# EAGLE design Display (EAGLE 8.5.1)
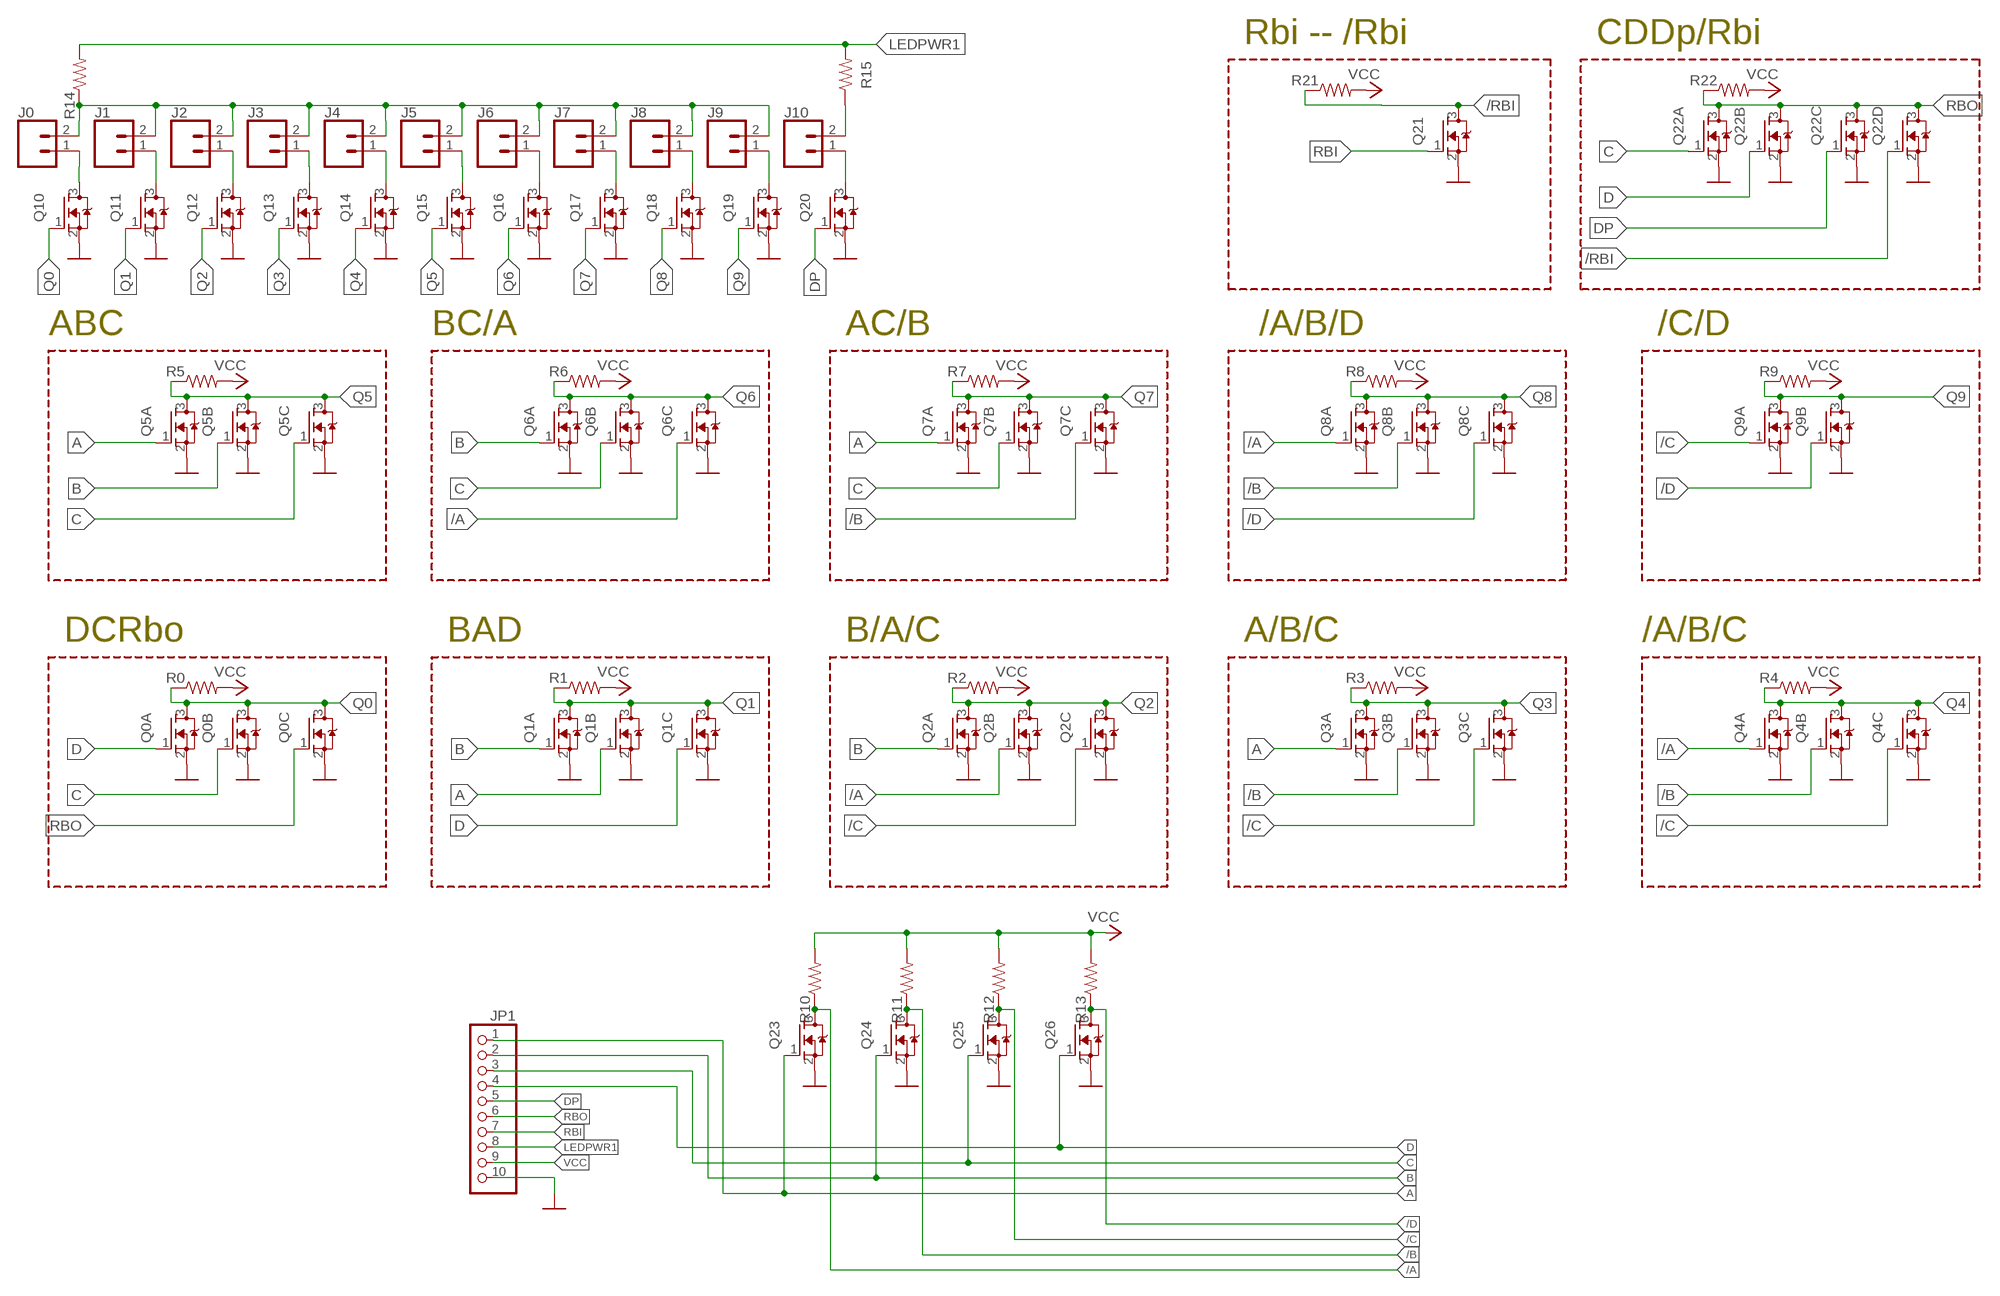
[diagram p0: schematic, sheet 1]

## Parts
J0  CONN_02  [1X02]
J1  CONN_02  [1X02]
J2  CONN_02  [1X02]
J3  CONN_02  [1X02]
J4  CONN_02  [1X02]
J5  CONN_02  [1X02]
J6  CONN_02  [1X02]
J7  CONN_02  [1X02]
J8  CONN_02  [1X02]
J9  CONN_02  [1X02]
J10  CONN_02  [1X02]
JP1  PINHD-1X10/90  [1X10/90]
Q0A  310mA/60V/1.6Ω  NMOSREFLOW  [SOT23]
Q0B  310mA/60V/1.6Ω  NMOSREFLOW  [SOT23]
Q0C  310mA/60V/1.6Ω  NMOSREFLOW  [SOT23]
Q1A  310mA/60V/1.6Ω  NMOSREFLOW  [SOT23]
Q1B  310mA/60V/1.6Ω  NMOSREFLOW  [SOT23]
Q1C  310mA/60V/1.6Ω  NMOSREFLOW  [SOT23]
Q2A  310mA/60V/1.6Ω  NMOSREFLOW  [SOT23]
Q2B  310mA/60V/1.6Ω  NMOSREFLOW  [SOT23]
Q2C  310mA/60V/1.6Ω  NMOSREFLOW  [SOT23]
Q3A  310mA/60V/1.6Ω  NMOSREFLOW  [SOT23]
Q3B  310mA/60V/1.6Ω  NMOSREFLOW  [SOT23]
Q3C  310mA/60V/1.6Ω  NMOSREFLOW  [SOT23]
Q4A  310mA/60V/1.6Ω  NMOSREFLOW  [SOT23]
Q4B  310mA/60V/1.6Ω  NMOSREFLOW  [SOT23]
Q4C  310mA/60V/1.6Ω  NMOSREFLOW  [SOT23]
Q5A  310mA/60V/1.6Ω  NMOSREFLOW  [SOT23]
Q5B  310mA/60V/1.6Ω  NMOSREFLOW  [SOT23]
Q5C  310mA/60V/1.6Ω  NMOSREFLOW  [SOT23]
Q6A  310mA/60V/1.6Ω  NMOSREFLOW  [SOT23]
Q6B  310mA/60V/1.6Ω  NMOSREFLOW  [SOT23]
Q6C  310mA/60V/1.6Ω  NMOSREFLOW  [SOT23]
Q7A  310mA/60V/1.6Ω  NMOSREFLOW  [SOT23]
Q7B  310mA/60V/1.6Ω  NMOSREFLOW  [SOT23]
Q7C  310mA/60V/1.6Ω  NMOSREFLOW  [SOT23]
Q8A  310mA/60V/1.6Ω  NMOSREFLOW  [SOT23]
Q8B  310mA/60V/1.6Ω  NMOSREFLOW  [SOT23]
Q8C  310mA/60V/1.6Ω  NMOSREFLOW  [SOT23]
Q9A  310mA/60V/1.6Ω  NMOSREFLOW  [SOT23]
Q9B  310mA/60V/1.6Ω  NMOSREFLOW  [SOT23]
Q10  310mA/60V/1.6Ω  NMOSREFLOW  [SOT23]
Q11  310mA/60V/1.6Ω  NMOSREFLOW  [SOT23]
Q12  310mA/60V/1.6Ω  NMOSREFLOW  [SOT23]
Q13  310mA/60V/1.6Ω  NMOSREFLOW  [SOT23]
Q14  310mA/60V/1.6Ω  NMOSREFLOW  [SOT23]
Q15  310mA/60V/1.6Ω  NMOSREFLOW  [SOT23]
Q16  310mA/60V/1.6Ω  NMOSREFLOW  [SOT23]
Q17  310mA/60V/1.6Ω  NMOSREFLOW  [SOT23]
Q18  310mA/60V/1.6Ω  NMOSREFLOW  [SOT23]
Q19  310mA/60V/1.6Ω  NMOSREFLOW  [SOT23]
Q20  310mA/60V/1.6Ω  NMOSREFLOW  [SOT23]
Q21  310mA/60V/1.6Ω  NMOSREFLOW  [SOT23]
Q22A  310mA/60V/1.6Ω  NMOSREFLOW  [SOT23]
Q22B  310mA/60V/1.6Ω  NMOSREFLOW  [SOT23]
Q22C  310mA/60V/1.6Ω  NMOSREFLOW  [SOT23]
Q22D  310mA/60V/1.6Ω  NMOSREFLOW  [SOT23]
Q23  310mA/60V/1.6Ω  NMOSREFLOW  [SOT23]
Q24  310mA/60V/1.6Ω  NMOSREFLOW  [SOT23]
Q25  310mA/60V/1.6Ω  NMOSREFLOW  [SOT23]
Q26  310mA/60V/1.6Ω  NMOSREFLOW  [SOT23]
R0  RESISTOR0805  [0805]
R1  RESISTOR0805  [0805]
R2  RESISTOR0805  [0805]
R3  RESISTOR0805  [0805]
R4  RESISTOR0805  [0805]
R5  RESISTOR0805  [0805]
R6  RESISTOR0805  [0805]
R7  RESISTOR0805  [0805]
R8  RESISTOR0805  [0805]
R9  RESISTOR0805  [0805]
R10  RESISTOR0805  [0805]
R11  RESISTOR0805  [0805]
R12  RESISTOR0805  [0805]
R13  RESISTOR0805  [0805]
R14  RESISTOR0805  [0805]
R15  RESISTOR0805  [0805]
R21  RESISTOR0805  [0805]
R22  RESISTOR0805  [0805]

## Nets
/A: Q2B.1(G) Q4A.1(G) Q6C.1(G) Q8A.1(G) Q23.3(D) R10.1
/B: Q3B.1(G) Q4B.1(G) Q7C.1(G) Q8B.1(G) Q24.3(D) R11.1
/C: Q2C.1(G) Q3C.1(G) Q4C.1(G) Q9A.1(G) Q25.3(D) R12.1
/D: Q8C.1(G) Q9B.1(G) Q26.3(D) R13.1
/RBI: Q21.3(D) Q22D.1(G) R21.1
A: JP1.1 Q1B.1(G) Q3A.1(G) Q5A.1(G) Q7A.1(G) Q23.1(G)
B: JP1.2 Q1A.1(G) Q2A.1(G) Q5B.1(G) Q6A.1(G) Q24.1(G)
C: JP1.3 Q0B.1(G) Q5C.1(G) Q6B.1(G) Q7B.1(G) Q22A.1(G) Q25.1(G)
D: JP1.4 Q0A.1(G) Q1C.1(G) Q22B.1(G) Q26.1(G)
DP: JP1.5 Q20.1(G) Q22C.1(G)
GND: JP1.10 Q0A.2(S) Q0B.2(S) Q0C.2(S) Q1A.2(S) Q1B.2(S) Q1C.2(S) Q2A.2(S) Q2B.2(S) Q2C.2(S) Q3A.2(S) Q3B.2(S) Q3C.2(S) Q4A.2(S) Q4B.2(S) Q4C.2(S) Q5A.2(S) Q5B.2(S) Q5C.2(S) Q6A.2(S) Q6B.2(S) Q6C.2(S) Q7A.2(S) Q7B.2(S) Q7C.2(S) Q8A.2(S) Q8B.2(S) Q8C.2(S) Q9A.2(S) Q9B.2(S) Q10.2(S) Q11.2(S) Q12.2(S) Q13.2(S) Q14.2(S) Q15.2(S) Q16.2(S) Q17.2(S) Q18.2(S) Q19.2(S) Q20.2(S) Q21.2(S) Q22A.2(S) Q22B.2(S) Q22C.2(S) Q22D.2(S) Q23.2(S) Q24.2(S) Q25.2(S) Q26.2(S)
LEDPWR: J0.2 J1.2 J2.2 J3.2 J4.2 J5.2 J6.2 J7.2 J8.2 J9.2 R14.1
LEDPWR1: JP1.8 R14.2 R15.2
N$2: J0.1 Q10.3(D)
N$4: J1.1 Q11.3(D)
N$6: J2.1 Q12.3(D)
N$7: J3.1 Q13.3(D)
N$8: J4.1 Q14.3(D)
N$9: J5.1 Q15.3(D)
N$10: J6.1 Q16.3(D)
N$11: J7.1 Q17.3(D)
N$12: J10.2 R15.1
N$13: J8.1 Q18.3(D)
N$14: J9.1 Q19.3(D)
N$15: J10.1 Q20.3(D)
Q0: Q0A.3(D) Q0B.3(D) Q0C.3(D) Q10.1(G) R0.1
Q1 [thin]: Q1A.3(D) Q1B.3(D) Q1C.3(D) Q11.1(G) R1.1
Q2 [thin]: Q2A.3(D) Q2B.3(D) Q2C.3(D) Q12.1(G) R2.1
Q3 [thin]: Q3A.3(D) Q3B.3(D) Q3C.3(D) Q13.1(G) R3.1
Q4 [thin]: Q4A.3(D) Q4B.3(D) Q4C.3(D) Q14.1(G) R4.1
Q5 [thin]: Q5A.3(D) Q5B.3(D) Q5C.3(D) Q15.1(G) R5.1
Q6 [thin]: Q6A.3(D) Q6B.3(D) Q6C.3(D) Q16.1(G) R6.1
Q7 [thin]: Q7A.3(D) Q7B.3(D) Q7C.3(D) Q17.1(G) R7.1
Q8 [thin]: Q8A.3(D) Q8B.3(D) Q8C.3(D) Q18.1(G) R8.1
Q9 [thin]: Q9A.3(D) Q9B.3(D) Q19.1(G) R9.1
RBI: JP1.7 Q21.1(G)
RBO: JP1.6 Q0C.1(G) Q22A.3(D) Q22B.3(D) Q22C.3(D) Q22D.3(D) R22.1
VCC: JP1.9 R0.2 R1.2 R2.2 R3.2 R4.2 R5.2 R6.2 R7.2 R8.2 R9.2 R10.2 R11.2 R12.2 R13.2 R21.2 R22.2

## Notes on the sheet
- Rbi -- /Rbi | CDDp/Rbi
- ABC | BC/A | AC/B | /A/B/D | /C/D
- DCRbo | BAD | B/A/C | A/B/C | /A/B/C

## Library data of the parts
J0 J1-J10 = SparkFun-Connectors:CONN_02: Multi connection point. Often used as Generic Header-pin footprint for 0.1 inch spaced/style header connections On any of the 0.1 inch spaced packages, you can populate with these: Break Away Headers - Straight <https://www.sparkfun.com/products/116> (PRT-00116) Break Away Male Headers - Right Angle <https://www.sparkfun.com/products/553> (PRT-00553) Female Headers <https://www.sparkfun.com/products/115> (PRT-00115) Break Away Headers - Machine Pin <https://www.sparkfun.com/products/117> (PRT-00117) Break Away Female Headers - Swiss Machine Pin <https://www.sparkfun.com/products/743> (PRT-00743) For SCREWTERMINALS and SPRING TERMINALS visit here: Screw Terimnals on SparkFun.com <https://www.sparkfun.com/search/results?term=Screw+Terminals> (5mm/3.5mm/2.54mm spacing) This device is also useful as a general connection point to wire up your design to another part of your project. Our various solder wires solder well into these plated through hole pads. Hook-Up Wire - Assortment (Stranded, 22 AWG) <https://www.sparkfun.com/products/11375> (PRT-11375) Hook-Up Wire - Assortment (Solid Core, 22 AWG) <https://www.sparkfun.com/products/11367> (PRT-11367) View the entire wire category on our website here <https://www.sparkfun.com/categories/141> Special notes: Molex polarized connector foot print use with: PRT-08233 with associated crimp pins and housings. 2.54_SCREWTERM for use with PRT-10571. 3.5mm Screw Terminal footprints for PRT-08084 5mm Screw Terminal footprints for use with PRT-08432
JP1 = XSNOR:PINHD-1X10: PIN HEADER
Q0A Q0B Q0C Q1A Q1B Q1C Q2A Q2B Q2C Q3A Q3B Q3C Q4A Q4B Q4C Q5A Q5B Q5C Q6A Q6B Q6C Q7A Q7B Q7C Q8A Q8B Q8C Q9A Q9B Q10-Q21 Q22A Q22B Q22C Q22D Q23-Q26 = XSNOR:NMOS: N-Channel Mosfet 2N7002E - 60V 260mA SOT23 [Digikey: 2N7002ET1GOSTR-ND] - REEL BSH103 - 30V 850mA SOT23 [Digikey: 568-5013-1-ND]
R0 R1-R15 R21 R22 = XSNOR:RESISTOR: Generic Resistor Package

## Net classes
0 default: width 0.2 mm, drill 0.305 mm, clearance 0.2 mm
1 thin: width 0.2 mm, drill 0.305 mm, clearance 0.2 mm

## Board
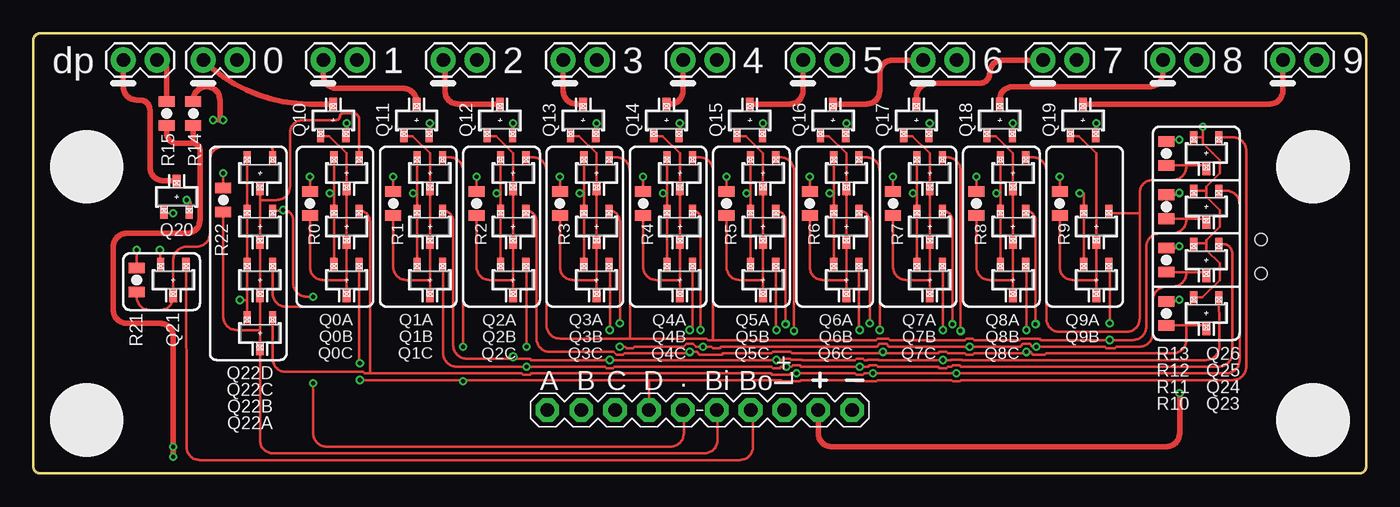
[diagram p1: board, top side]
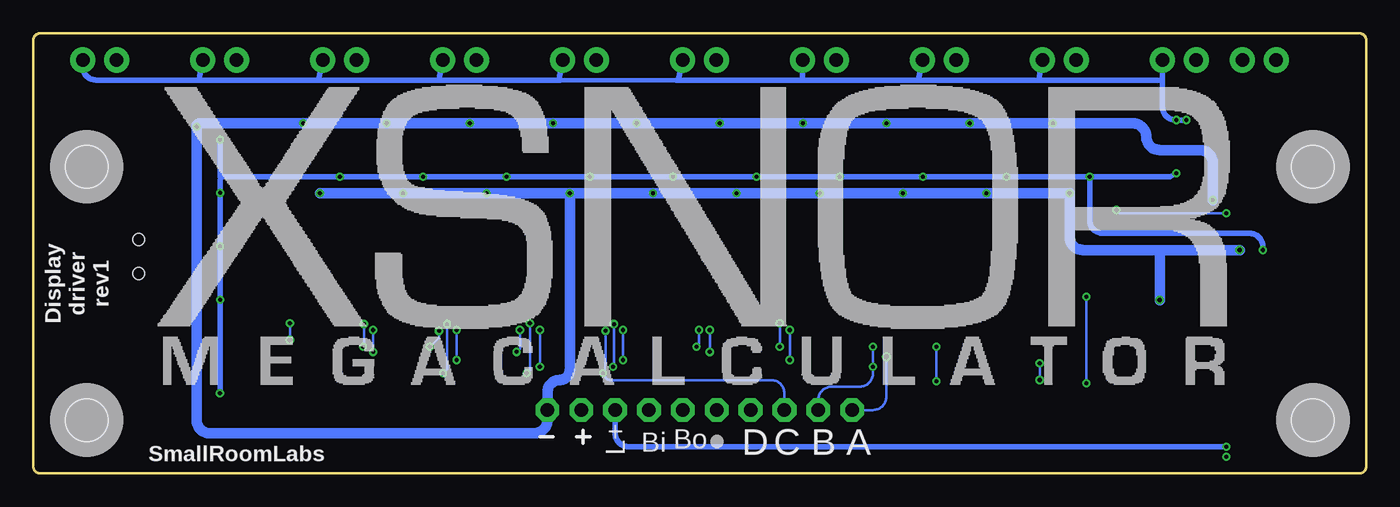
[diagram p2: board, bottom side, seen from below]

Size 100 x 33 mm. Coordinates in mm from the lower left corner, seen from the top.
Outline: 0,0.5 arc90 0.5,0 99.5,0 arc90 100,0.5 100,32.5 arc90 99.5,33 0.5,33 arc90 0,32.5 0,0.5
Copper layers (1*16): Top 0.035mm / dielectric 1.5mm / Bottom 0.035mm
Design rules "dirt_cheap_dirty_boards.v1": minimum track width 5mil, minimum drill 12mil, track to track 5mil, track to pad 5mil, pad to pad 5mil, via to via 5mil, smd to smd 0mil, copper to edge 10mil, drill to drill 10mil, minimum pad ring 10mil, minimum via ring 6mil, stop-mask expansion 2mil, vias tented up to drill 25mil, thermal gap 10mil
Holes 0.9 mm at 92.1,15 92.1,17.54
Holes 3.2 mm at 4,23 4,4 96,4 96,23

### Footprints (pad centres in the part's own frame; a part is rotated, then mirrored left to right if it is on the bottom)
1X02 = drill 1.016 pad 1.88: 1 0,0; 2 2.54,0
1X10/90 = drill 1.016 pad 1.778 octagon: 1 -11.43,0; 2 -8.89,0; 3 -6.35,0; 4 -3.81,0; 5 -1.27,0; 6 1.27,0; 7 3.81,0; 8 6.35,0; 9 8.89,0; 10 11.43,0
SOT23 = smd 0.6 x 0.9: 1 -0.95,-1.2; 2 0.95,-1.2 | smd 0.65 x 0.9: 3 0,1.2
0805 = smd 0.8 x 1.2: 1 -0.9,0; 2 0.9,0

### Placement (x,y rotation side)
J0  12.75,31 0 top
J1  21.75,31 0 top
J2  30.75,31 0 top
J3  39.75,31 0 top
J4  48.75,31 0 top
J5  57.75,31 0 top
J6  66.75,31 0 top
J7  75.75,31 0 top
J8  84.75,31 0 top
J9  93.75,31 0 top
J10  6.75,31 0 top
JP1  50,4.75 0 top
Q0A  23.5,14.5 180 top
Q0B  23.5,18.5 180 top
Q0C  23.5,22.5 180 top
Q1A  29.75,14.5 180 top
Q1B  29.75,18.5 180 top
Q1C  29.75,22.5 180 top
Q2A  36,14.5 180 top
Q2B  36,18.5 180 top
Q2C  36,22.5 180 top
Q3A  42.25,14.5 180 top
Q3B  42.25,18.5 180 top
Q3C  42.25,22.5 180 top
Q4A  48.5,14.5 180 top
Q4B  48.5,18.5 180 top
Q4C  48.5,22.5 180 top
Q5A  54.75,14.5 180 top
Q5B  54.75,18.5 180 top
Q5C  54.75,22.5 180 top
Q6A  61,14.5 180 top
Q6B  61,18.5 180 top
Q6C  61,22.5 180 top
Q7A  67.25,14.5 180 top
Q7B  67.25,18.5 180 top
Q7C  67.25,22.5 180 top
Q8A  73.5,14.5 180 top
Q8B  73.5,18.5 180 top
Q8C  73.5,22.5 180 top
Q9A  79.75,14.5 180 top
Q9B  79.75,18.5 180 top
Q10  22.5,26.5 0 top
Q11  28.75,26.5 0 top
Q12  35,26.5 0 top
Q13  41.25,26.5 0 top
Q14  47.5,26.5 0 top
Q15  53.75,26.5 0 top
Q16  60,26.5 0 top
Q17  66.25,26.5 0 top
Q18  72.5,26.5 0 top
Q19  78.75,26.5 0 top
Q20  10.75,20.75 0 top
Q21  10.5,14.5 180 top
Q22A  17,10.5 180 top
Q22B  17,14.5 180 top
Q22C  17,18.5 180 top
Q22D  17,22.5 180 top
Q23  88,12 180 top
Q24  88,16 180 top
Q25  88,20 180 top
Q26  88,24 180 top
R0  20.75,20.25 90 top
R1  27,20.25 90 top
R2  33.25,20.25 90 top
R3  39.5,20.25 90 top
R4  45.75,20.25 90 top
R5  52,20.25 90 top
R6  58.25,20.25 90 top
R7  64.5,20.25 90 top
R8  70.75,20.25 90 top
R9  77,20.25 90 top
R10  85,12 90 top
R11  85,16 90 top
R12  85,20 90 top
R13  85,24 90 top
R14  12,27 270 top
R15  10,27 270 top
R21  7.75,14.5 90 top
R22  14.25,20.5 90 top

### Tracks (layer width: path | path; a pad name or v marks a point on that pad's centre or on a via)
/A  (via drill 0.3)
  Top 0.2: R10.1 86.5,11.1 | 86.5,11.1 88,11.1 Q23.3 | 49.5,15.65 Q4A.1 49.45,10.95 v49.25,10.75 | Q8A.1 74.5,15.65 v74.5,10.75 | 43.75,8.9 44.25,8.9 44.35,8.99 48.25,8.99 | 43.75,8.9 43.55,9.11 | 43.55,9.11 43.75,8.9 | 48.5,9 48.49,8.99 48.25,8.99 | 48.25,8.99 49.14,8.99 v49.25,9.11 49.8,9.11 50,8.9 51.65,8.9 51.75,9 55.4,9 55.5,9.11 56.82,9.11 56.92,9 61.58,9 61.58,9.01 63.65,9.01 v63.75,9.11 63.9,9.11 64,9 67.89,9 68,9.11 68.5,9.11 68.61,9 69.9,9 70,8.9 | 70,8.9 | 70,8.9 70.5,8.9 70.6,9 74.39,9 v74.5,9.11 74.8,9.11 75,8.9 75.9,8.9 76,9 80.33,9 80.33,8.99 85.5,8.99 arc90 86.5,9.99 86.5,11.1 | 70,8.9 | Q2B.1 arc-90 37.75,18.9 37.75,10.11 arc90 38.75,9.11 43.55,9.11 | Q6C.1 62.5,23.7 arc-90 63.5,22.7 v63.5,10.75
  Bottom 0.2: v49.25,10.75 v49.25,9.11 | v63.5,10.75 63.5,9.36 v63.75,9.11 | v74.5,10.75 v74.5,9.11
/B  (via drill 0.3)
  Top 0.2: R11.1 86.5,15.1 | 86.5,15.1 88,15.1 Q24.3 | v44,9.51 44.39,9.51 44.5,9.39 45,9.39 45.11,9.51 48.8,9.51 49,9.71 49.5,9.71 49.7,9.51 v50.25,9.51 50.89,9.51 51,9.39 51.5,9.39 51.61,9.51 63.3,9.51 63.5,9.71 64,9.71 64.2,9.51 v70.25,9.51 74.05,9.51 74.25,9.71 74.75,9.71 74.95,9.51 v75.25,9.51 80.39,9.51 80.5,9.39 81.14,9.39 81.25,9.5 83,9.5 arc90 84,10.5 84,13 arc-90 85,14 85.5,14 arc90 86.5,15 86.5,15.1 | Q3B.1 arc-90 44,18.9 v44,11.25 | Q4B.1 arc-90 50.06,19.09 v50.06,10.75 | Q7C.1 68.57,23.7 arc-90 69.57,22.7 v69.57,10.68 | Q8B.1 arc-90 75.2,18.95 v75.2,11.2
  Bottom 0.2: v44,11.25 v44,9.51 | v50.06,10.75 50.06,9.7 v50.25,9.51 | v69.57,10.68 69.57,10.18 v70.25,9.51 | v75.2,11.2 75.2,9.56 v75.25,9.51
/C  (via drill 0.3)
  Top 0.2: R12.1 86.5,19.1 | 86.5,19.1 88,19.1 Q25.3 | Q9A.1 80.75,15.65 v80.75,11.25 | 50,10.11 | 50,10.11 50.5,10.11 50.61,10 51,10 | Q2C.1 37.5,23.7 arc-90 38.5,22.7 38.5,11.11 arc90 39.5,10.11 44.75,10.11 | Q3C.1 43.75,23.7 arc-90 44.75,22.7 44.75,11.5 | 44.75,11.5 44.75,11.25 | Q4C.1 50,23.7 arc-90 51,22.7 51,10 | 86.5,19.1 86.5,19 arc-90 85.5,18 84.5,18 arc90 83.5,17 83.5,11 arc-90 82.5,10 v80.75,10 75.61,10 75.5,10.11 74.08,10.11 73.97,10 70.61,10 70.5,10.11 70,10.11 69.89,10 64.28,10 64.17,10.11 63.33,10.11 63.22,10 51,10 | 50,10.11 44.75,10.11 | 44.75,11.5 44.75,10.11
  Bottom 0.2: v80.75,11.25 v80.75,10
/D
  Top 0.2: R13.1 86.5,23.1 | 86.5,23.1 88,23.1 Q26.3 | 86.5,23.1 86.5,23 arc-90 85.5,22 84,22 arc90 83,21 83,19.5 | 83,19.5 80.9,19.5 Q9B.1 | Q8C.1 75,23.7 arc-90 76,22.7 76,11.61 arc90 77,10.61 82,10.61 arc90 83,11.61 83,19.5
/RBI
  Top 0.2: Q22D.1 17.95,24.3 17.75,24.5 14.25,24.5 arc90 13.25,23.5 13.25,18 arc-90 12.25,17 11.5,17 arc90 10.5,16 10.5,14.25 Q21.3 10.5,13.25 arc-90 9.5,12.25 8.75,12.25 arc-90 7.75,13.25 R21.1
A  (via drill 0.3, 0.35)
  Top 0.2: Q23.1 88.98,11 88.98,9.5 arc-90 87.98,8.5 69.67,8.5 69.67,8.51 68.83,8.51 68.83,8.5 v68.25,8.5 63.42,8.5 63.42,8.51 62.58,8.51 62.58,8.5 62.35,8.5 62.25,8.61 61.75,8.61 61.65,8.5 57.67,8.5 57.67,8.51 56.85,8.51 56.75,8.61 56.25,8.61 56.15,8.5 v55.75,8.5 v43.25,8.5 37.35,8.5 37.25,8.61 36,8.61 | Q3A.1 43.25,15.65 v43.25,10.75 | Q7A.1 68.25,15.65 v68.25,10.75 | Q5A.1 55.7,10.8 v55.75,10.75 | Q1B.1 arc-90 31.5,18.9 31.5,9.61 arc90 32.5,8.61 36,8.61 | v36,8.75 36,8.61
  Bottom 0.2: v43.25,10.75 v43.25,8.5 | v55.75,10.75 v55.75,8.5 | v68.25,10.75 v68.25,8.5 | JP1.1 37,4.75 arc-90 36,5.75 v36,8.75
B  (via drill 0.3)
  Top 0.2: Q24.1 89.25,17.2 arc-90 89.94,16.51 89.94,9 arc-90 88.94,8 69.61,8 69.5,8.11 69,8.11 68.89,8 68.61,8 68.5,7.89 68,7.89 67.89,8 63.35,8 63.25,8.11 62.75,8.11 62.65,8 v62,8 57.6,8 57.5,8.11 57,8.11 56.9,8 v56.5,8 56.1,8 56,7.89 55.5,7.89 55.4,8 43.6,8 43.5,7.89 43,7.89 42.9,8 v37,8 31.75,8 arc-90 30.75,9 30.75,15.65 Q1A.1 | Q2A.1 37,15.65 v37,9.5 | Q6A.1 61.95,11.05 v62,10.75 | Q5B.1 arc-90 56.45,18.95 v56.45,11.2
  Bottom 0.2: v37,9.5 v37,8 37,7.5 arc90 38,6.5 40.11,6.5 arc-90 41.11,5.5 JP1.2 | v56.45,11.2 56.45,8.05 v56.5,8 | v62,10.75 v62,8
C  (via drill 0.3)
  Top 0.2: Q25.1 89.5,21.2 arc-90 90.5,20.2 90.5,8.5 arc-90 89.5,7.5 v69.25,7.5 68.67,7.5 67.83,7.5 v63,7.5 62.35,7.5 62.25,7.39 61.75,7.39 61.65,7.5 v57.25,7.5 56.85,7.5 56.75,7.39 56.25,7.39 56.24,7.4 55.43,7.4 55.33,7.5 45.75,7.5 43.67,7.5 42.83,7.5 37.35,7.5 37.25,7.39 36.75,7.39 36.65,7.5 31.92,7.5 29,7.5 arc-90 29,7.5 25.75,7.5 25.25,7.5 | 25.25,7.5 24.86,7.5 24.75,7.61 18.95,7.61 arc-90 17.95,8.61 Q22A.1 | Q0B.1 arc-90 25.25,18.9 25.25,7.5 | Q5C.1 56.07,23.7 arc-90 57.07,22.7 v57.07,10.68 | Q6B.1 arc-90 62.75,18.9 v62.75,11.25 | Q7B.1 arc-90 68.95,18.95 v68.95,11.2
  Bottom 0.2: v57.07,10.68 57.07,8.28 57.1,8.25 57.1,7.64 v57.25,7.5 57.12,7.38 arc-90 56.75,7 44.65,7 arc90 43.65,6 JP1.3 | v62.75,11.25 62.75,7.75 v63,7.5 | v68.95,11.2 68.95,7.8 v69.25,7.5
D  (via drill 0.3)
  Top 0.2: Q26.1 90,25.2 arc-90 91,24.2 91,8 arc-90 90,7 69.61,7 69.5,6.89 69,6.89 68.89,7 63.35,7 63.25,6.89 61.68,6.89 61.58,7 57.6,7 57.5,6.89 56.18,6.89 56.08,7 46.25,7 | 24.5,15.65 Q0A.1 24.45,12.5 | 24.45,12.5 24.45,8.55 v24.5,8.25 | v24.5,7 24.75,7 arc90 24.75,7 32.15,7 32.2,6.95 | v32.25,6.89 32.2,6.95 | 46.25,7 37.42,7 32.24,7 32.2,6.95 | JP1.4 46.19,6.94 46.25,7 | Q22B.1 17.95,13.5 arc90 18.95,12.5 24.45,12.5 | Q1C.1 31.25,23.7 arc-90 32.25,22.7 v32.25,9.5
  Bottom 0.2: v24.5,8.25 v24.5,7 | v32.25,9.5 v32.25,6.89
DP  (via drill 0.3)
  Top 0.2: Q20.1 10.1,19.5 v10.5,19.5 | Q22C.1 18.7,19.7 v18.75,19.75 arc-90 19.5,19 19.5,14.25 arc90 20.5,13.25 v21,13.25 | JP1.5 48.8,4.68 48.8,3 arc-90 47.8,2 22,2 arc-90 21,3 v21,6.75
  Bottom 0.2: v18.75,19.75 18.5,19.5 v10.5,19.5 | v21,6.75 v21,13.25
GND  (via drill 0.3, 0.3 pad 0.3)
  Top 0.2: Q20.2 11.75,19.82 | Q10.2 23.5,25.1 | Q11.2 29.75,25.1 | Q12.2 36,25.1 | Q13.2 42.25,25.1 | Q14.2 48.5,25.1 | Q15.2 54.75,25.1 | Q16.2 61,25.1 | Q17.2 67.25,25.35 v67.25,26.25 | Q19.2 79.75,25.1 | Q18.2 73.5,25.1 | Q23.2 87.7,13.2 89,14.5 89,15.75 88,16.75 88,17.25 | 88,17.25 88,17.5 89,18.5 89,19.75 88,20.75 88,21.25 | Q24.2 87.1,17.25 88,17.25 | 88,21.25 88,21.5 89,22.5 89,23.5 88.5,24 87.75,24.75 87.75,25.25 | 87.75,25.25 v87.75,26 | Q26.2 87.7,25.2 87.75,25.25 | Q25.2 87.95,21.2 88,21.25 | Q0A.2 Q0B.2 22.55,21 | 22.55,21 Q0C.2 | v22.25,21 22.55,21 | Q1A.2 Q1B.2 28.8,21 | 28.8,21 Q1C.2 | v28.5,21 28.8,21 | Q2A.2 Q2B.2 35.05,21 | 35.05,21 Q2C.2 | v34.75,21 35.05,21 | Q3A.2 Q3B.2 41.3,21 | 41.3,21 Q3C.2 | v41,21 41.3,21 | Q4A.2 Q4B.2 47.55,21 | 47.55,21 Q4C.2 | v47.25,21 47.55,21 | Q5A.2 Q5B.2 53.8,21 | 53.8,21 Q5C.2 | v53.5,21 53.8,21 | Q6A.2 Q6B.2 60.05,21 | 60.05,21 Q6C.2 | v59.75,21 60.05,21 | Q7A.2 Q7B.2 66.3,21 | 66.3,21 Q7C.2 | v66,21 66.3,21 | Q8A.2 Q8B.2 72.55,21 | 72.55,21 Q8C.2 | v72.25,21 72.55,21 | Q9A.2 Q9B.2 78.8,21 v78.5,21 | Q22A.2 16.05,13 | 16.05,13 Q22B.2 Q22C.2 Q22D.2 | v9.5,16.75 9.5,15.75 Q21.2 | v15.5,13 16.05,13
  Top 0.35: 23.5,25.1 v23.5,26.25 | 29.75,25.1 v29.75,26.25 | 36,25.1 v36,26.25 | 42.25,25.1 v42.25,26.25 | 48.5,25.1 v48.5,26.25 | 54.75,25.1 v54.75,26.25 | 61,25.1 v61,26.25 | 79.75,25.1 v79.75,26.25 | 73.5,25.1 v73.5,26.25
  Top 0.4: Q20.2 11.7,20.3 v11.5,20.5
  Bottom 0.8: v11.5,20.5 11.5,23.25 arc-90 12.5,24.25 15.5,24.25 arc90 16.5,25.25 arc-90 17.5,26.25 v23.5,26.25 v29.75,26.25 v36,26.25 v42.25,26.25 v48.5,26.25 v54.75,26.25 v61,26.25 v67.25,26.25 v73.5,26.25 v79.75,26.25 87.5,26.25 arc-90 v87.75,26 87.75,4 arc-90 86.75,3 62.43,3 arc-90 61.43,4 JP1.10 61.43,6.07 arc90 60.5,7 arc-90 59.75,7.75 v59.75,21 | v59.75,21 v53.5,21 v47.25,21 v41,21 v34.75,21 v28.5,21 v22.25,21 22.25,17.75 arc-90 21.25,16.75 15.25,16.75 | v59.75,21 v66,21 v72.25,21 v78.5,21 | v9.5,16.75 15.25,16.75 | v15.5,13 15.5,16.5 arc90 15.25,16.75
LEDPWR  (via drill 0.3 pad 0.3)
  Top 0.35: 14,26.5 v13.5,26.5
  Top 0.4: R14.1 12,28 arc-90 13,29 arc-90 14,28 14,26.5 v14.25,26.5
  Bottom 0.35: 87.54,29.54 87.5,29.5 | 78.54,29.71 78.75,29.5 | 69.54,29.54 69.5,29.5 | 60.54,29.54 60.5,29.5 51.75,29.5 51.54,29.71 | 42.29,29.71 42.5,29.5 | 33.54,29.71 33.75,29.5
  Bottom 0.4: 13.54,26.5 v14.25,26.5 14.29,26.5 arc90 15.29,27.5 15.29,29.5 | J0.2 15.29,29.5 | 60.5,29.5 69.5,29.5 78.75,29.5 87.5,29.5 95.29,29.5 arc90 96.29,30.5 J9.2 | 51.75,29.5 42.5,29.5 33.75,29.5 24.5,29.5 | 24.5,29.5 15.29,29.5 | J8.2 87.54,29.54 | J7.2 78.54,29.71 | J6.2 69.54,29.54 | J5.2 60.54,29.54 | J4.2 51.54,29.71 | J3.2 42.29,29.71 | J2.2 33.54,29.71 | J1.2 24.54,29.54 24.5,29.5
LEDPWR1  (via drill 0.3 pad 0.3)
  Top 0.4: R15.2 10,25.5 arc90 10.75,24.75 12,24.75 | R14.2 12,24.75 | 12,24.75 arc-90 12.5,24.25 12.5,19 arc-90 11.5,18 7,18 arc90 6,17 6,12.25 arc90 7,11.25 9.5,11.25 arc-90 10.5,10.25 v10.5,2 v10.5,1.25
  Bottom 0.4: JP1.8 56.35,3 arc-90 55.35,2 v10.5,2
N$2
  Top 0.4: J0.1 arc45 20.72,27.7 Q10.3
N$4
  Top 0.4: Q11.3 28.75,27.88 arc90 27.75,28.88 22.75,28.88 arc-90 21.75,29.88 J1.1
N$6
  Top 0.4: J2.1 30.88,30.88 30.88,28.7 arc90 31.88,27.7 Q12.3
N$7
  Top 0.4: Q13.3 40.75,27.7 arc-90 39.75,28.7 J3.1
N$8
  Top 0.4: Q14.3 47.75,27.7 arc90 48.75,28.7 J4.1
N$9
  Top 0.4: Q15.3 56.75,27.7 arc90 57.75,28.7 J5.1
N$10
  Top 0.4: Q16.3 62.5,27.7 arc90 63.5,28.7 63.5,30 arc-90 64.5,31 J6.1
N$11
  Top 0.4: Q17.3 66.25,28.25 arc-90 67.25,29.25 71,29.25 arc90 71.75,30 arc-90 72.75,31 J7.1
N$12
  Top 0.4: R15.1 10,30.29 arc90 J10.2
N$13
  Top 0.4: Q18.3 72.5,28 arc-90 73.5,29 83.75,29 arc90 84.75,30 J8.1
N$14
  Top 0.4: Q19.3 92.75,27.7 arc90 93.75,28.7 J9.1
N$15
  Top 0.4: Q20.3 9.75,21.95 arc-90 8.75,22.95 8.75,27.25 arc90 8,28 7.75,28 arc-90 6.75,29 J10.1
Q0
  Top 0.2: Q0A.3 23.5,14.5 | 23.5,14.5 Q0B.3 Q0C.3 23.5,24 22.2,25.3 Q10.1 | 23.5,14.5 21.75,14.5 arc-90 20.75,15.5 R0.1
Q1
  Top 0.2: Q1A.3 29.75,14.5 | 29.75,14.5 Q1B.3 Q1C.3 29.75,24 28.45,25.3 Q11.1 | 29.75,14.5 28,14.5 arc-90 27,15.5 R1.1
Q2
  Top 0.2: Q2A.3 36,14.5 | 36,14.5 Q2B.3 Q2C.3 36,24 34.7,25.3 Q12.1 | R2.1 33.25,15.5 arc90 34.25,14.5 36,14.5
Q3
  Top 0.2: Q3A.3 42.25,14.5 | 42.25,14.5 Q3B.3 Q3C.3 42.25,24 40.95,25.3 Q13.1 | 42.25,14.5 40.5,14.5 arc-90 39.5,15.5 R3.1
Q4
  Top 0.2: Q4A.3 48.5,14.5 | 48.5,14.5 Q4B.3 Q4C.3 48.5,24 47.2,25.3 Q14.1 | 48.5,14.5 46.75,14.5 arc-90 45.75,15.5 R4.1
Q5
  Top 0.2: Q5A.3 54.75,14.5 | 54.75,14.5 Q5B.3 Q5C.3 54.75,24 53.45,25.3 Q15.1 | 54.75,14.5 53,14.5 arc-90 52,15.5 R5.1
Q6
  Top 0.2: Q6A.3 61,14.5 | 61,14.5 Q6B.3 Q6C.3 61,24 59.7,25.3 Q16.1 | R6.1 58.25,15.5 arc90 59.25,14.5 61,14.5
Q7
  Top 0.2: Q7A.3 67.25,14.5 | 67.25,14.5 Q7B.3 Q7C.3 67.25,24 65.95,25.3 Q17.1 | 67.25,14.5 65.5,14.5 arc-90 64.5,15.5 R7.1
Q8
  Top 0.2: Q8A.3 73.5,14.5 | 73.5,14.5 Q8B.3 Q8C.3 73.5,24 72.2,25.3 Q18.1 | R8.1 70.75,15.5 arc90 71.75,14.5 73.5,14.5
Q9
  Top 0.2: Q9A.3 79.75,14.5 | 79.75,14.5 Q9B.3 79.75,24 78.75,25 78.45,25.3 Q19.1 | R9.1 77,15.5 arc90 78,14.5 79.75,14.5
RBI
  Top 0.2: Q21.1 11.49,3 11.49,2 arc90 12.49,1 53,1 arc90 54,2 54,4.56 JP1.7
RBO
  Top 0.2: Q22D.3 17,20.5 | 17,20.5 Q22C.3 Q22B.3 17,10.75 | 17,10.75 Q22A.3 17,2.5 arc90 18,1.5 50.34,1.5 arc90 51.34,2.5 51.34,4.68 JP1.6 | 17,20.5 18.25,20.5 arc90 19.25,21.5 19.25,25.5 arc-90 20.25,26.5 22.75,26.5 arc90 23,26.75 arc-90 23.25,27 24,27 arc-90 24.45,26.55 Q0C.1 | 17,10.75 15.25,10.75 arc-90 14.25,11.75 R22.1
VCC  (via drill 0.3)
  Top 0.2: R22.2 v14.25,22.5 | R21.2 v7.75,16.75 | R10.2 85.97,12.9 v85.97,13.03 | R11.2 85.97,16.9 v85.97,17.03 | R12.2 85.97,20.9 v85.97,21.03 | R13.2 85,25.03 v85.97,25.03 | R0.2 20.75,22 v20.75,22.25 | R1.2 27,22 v27,22.25 | R2.2 33.25,22 v33.25,22.25 | R3.2 39.5,22 v39.5,22.25 | R4.2 45.75,22 v45.75,22.25 | R5.2 52,22 v52,22.25 | R6.2 58.25,22 v58.25,22.25 | R7.2 64.5,22 v64.5,22.25 | R8.2 70.75,22 v70.75,22.25 | R9.2 77,22 v77,22.25
  Top 0.4: JP1.9 58.89,3 arc90 59.89,2 85,2 arc90 86,3 v86,6
  Bottom 0.25: 85.97,22 85.97,22.25
  Bottom 0.4: 85.97,22 v85.97,21.03 v85.97,17.03 v85.97,13.03 86,13 v86,6 | v85.97,25.03 85.97,22.25 v77,22.25 v70.75,22.25 v64.5,22.25 v58.25,22.25 v52,22.25 v45.75,22.25 v39.5,22.25 v33.25,22.25 v27,22.25 v20.75,22.25 | v20.75,22.25 14.75,22.25 v14.25,22.5 | v7.75,16.75 7.75,17 arc-90 8.75,18 19.75,18 arc90 20.75,19 v20.75,22.25

### Text on the board
tPlace: dp | 0 | 1 | 2 | 3 | 4 | 5 | 6 | 7 | 8 | 9 | Bi | Bo | A | B | C | D | . | L+
bPlace: Display / driver / rev1 | A | B | C | D | Bo | Bi | L+ | SmallRoomLabs
Reference: 49T 18R 0C | 8 | 14 | 23 | 32 | 41 | 50 | 59 | 68 | 86 | 95 | 77 | 15mm standoff height / 0.8 mm PCB thickness / =15.8mm /2=7.9mm